# Altium schematic sheet Connectors.SchDoc
size 406 x 304 mm; SheetNumber: 5; SheetTotal: 6
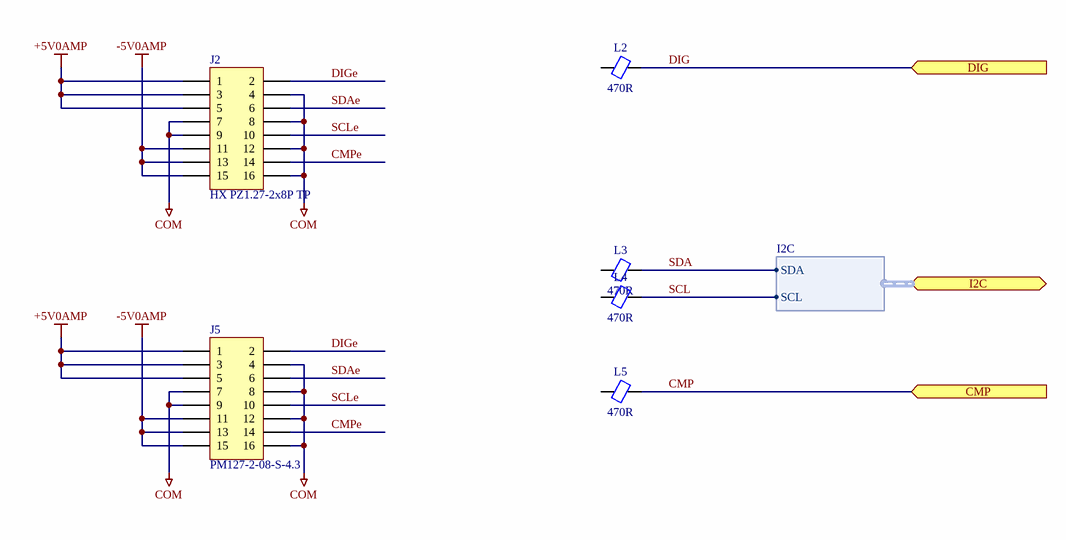
[diagram p0: Connectors.SchDoc]

## Parts
J2  HX PZ1.27-2x8P TP  [HANXIA_HX PZ1.27-2x8P TP]
J5  PM127-2-08-S-4.3  [HCTL_PM127-2-08-S-4.3]
L2  470R  [INDC1005X05N]
L3  470R  [INDC1005X05N]
L4  470R  [INDC1005X05N]
L5  470R  [INDC1005X05N]

## Ports
CMP (in), DIG (in), I2C (bidir, harness I2C)

## Harnesses
I2C: SDA, SCL

## Nets
+5V0AMP: J2.1 J2.3 J2.5 J5.1 J5.3 J5.5
-5V0AMP: J2.11 J2.13 J2.15 J5.11 J5.13 J5.15
COM: J2.4 J2.7 J2.8 J2.9 J2.12 J2.16 J5.4 J5.7 J5.8 J5.9 J5.12 J5.16
CMP: L5.2 ; port CMP
CMPe: J2.14 J5.14
DIG: L2.2 ; port DIG
DIGe: J2.2 J5.2
SCL: L4.2 ; port I2C.SCL
SCLe: J2.10 J5.10
SDA: L3.2 ; port I2C.SDA
SDAe: J2.6 J5.6

Not connected (* = marked no-connect by the designer): L2 1; L3 1; L4 1; L5 1

## Notes on the sheet
- Rev
- Sheet Name:
- Date:
- Sheet
- Designer:
- of

## Library data of the parts
J2 = CONN,Hdr,2x8 Pin,1.27mm,SMD: CONN HEADER 16POS 1.27mm DUAL ROW SMD; Manufacturer 1: hanxia; Vendor 1 Part Number: C41376040; Vendor 1: LCSC; Part Name: CONN,Hdr,2x8 Pin,1.27mm,SMD; CreatedBy: Judd Foster; HelpURL: https://www.lcsc.com/datasheet/C41376040.pdf?spm=wm.sxq.inf.ggs___wm.fly.bg.0.xh&lcsc_vid=T1ELXwUHQlNYVlZRE1JdXlRQFVgNBF1eTlFXBVxWRAAxVlNeQ1lYVlFUQlNXXjsOAxUeFF5JWBYZEEoKFBINSQcJGk4eFQsCAgIaSgADAwAHC0slRFhZUlVVQ08GEwkK; Manufacturer 1 Part Number: HX PZ1.27-2x8P TP
J5 = CONN,Rcpt,2x8 Pin,1.27mm,SMD: CONN SOCKET 16POS 1.27mm DUAL ROW SMD; Manufacturer 1: HCTL; Vendor 1 Part Number: C3975134; Vendor 1: LCSC; Part Name: CONN,Rcpt,2x8 Pin,1.27mm,SMD; CreatedBy: Judd Foster; HelpURL: https://www.lcsc.com/datasheet/C3975134.pdf?spm=wm.sxq.inf.ggs___wm.fly.bg.0.xh&lcsc_vid=T1ELXwUHQlNYVlZRE1JdXlRQFVgNBF1eTlFXBVxWRAAxVlNeQ1lYVldfR1VbXjsOAxUeFF5JWBYZEEoKFBINSQcJGk4dAgUUFAk%3D; Manufacturer 1 Part Number: PM127-2-08-S-4.3
L2-L5 = Ferrite,470R@100MHz,0402: 470 Ohms @ 100 MHz 1 Power Line Ferrite Bead 0402 (1005 Metric) 1A 200mOhm; Manufacturer 1: Murata Electronics; Manufacturer 1 Part Number: BLM15PX471SN1D; Vendor 1 Part Number: 490-10662-1-ND; Vendor 1: Digikey; Part Name: Ferrite,470R@100MHz,0402; CreatedBy: Judd Foster; HelpURL: https://www.murata.com/en-us/products/productdata/8796740059166/ENFA0018.pdf; Value: 470R